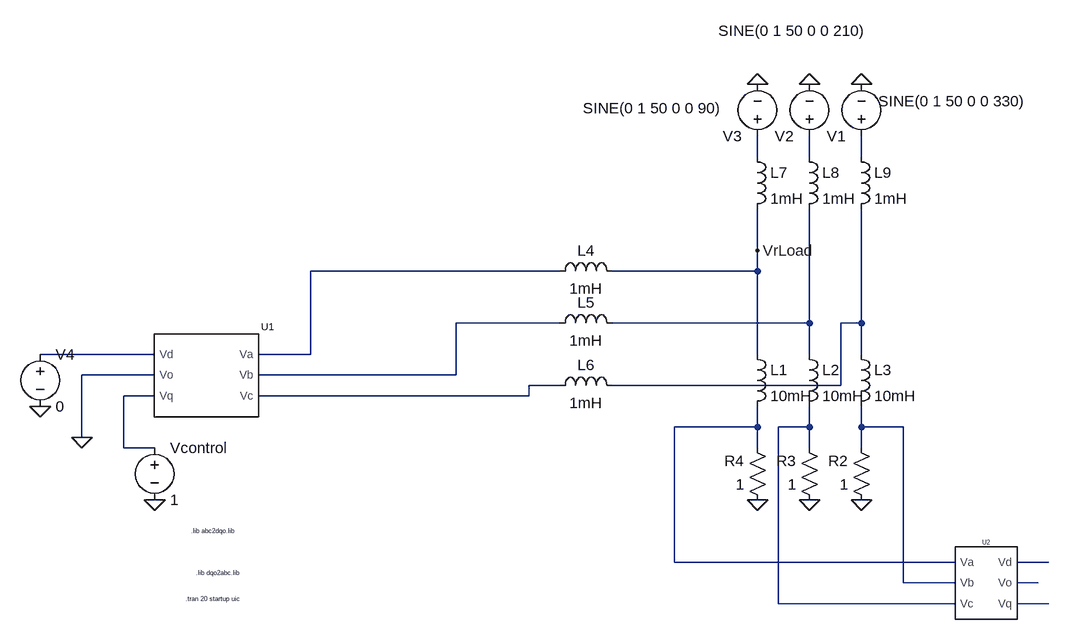
[diagram p0: schematic dqoabc4.asc]
dqoabc4.asc, the LTspice schematic file:
Version 4
SHEET 1 3872 1864
WIRE 976 -16 976 -48
WIRE 1056 -16 1056 -48
WIRE 1136 -16 1136 -48
WIRE 976 128 976 64
WIRE 672 160 288 160
WIRE 976 160 976 128
WIRE 976 160 752 160
WIRE 672 240 512 240
WIRE 1056 240 1056 64
WIRE 1056 240 752 240
WIRE 1136 240 1136 64
WIRE 1136 240 1104 240
WIRE 48 288 -128 288
WIRE 288 288 288 160
WIRE 288 288 208 288
WIRE 976 288 976 160
WIRE 1056 288 1056 240
WIRE 1136 288 1136 240
WIRE 48 320 -64 320
WIRE 512 320 512 240
WIRE 512 320 208 320
WIRE 672 336 624 336
WIRE 1104 336 1104 240
WIRE 1104 336 752 336
WIRE 48 352 0 352
WIRE 624 352 624 336
WIRE 624 352 208 352
WIRE 976 400 976 368
WIRE 976 400 848 400
WIRE 1056 400 1056 368
WIRE 1056 400 1008 400
WIRE 1136 400 1136 368
WIRE 1200 400 1136 400
WIRE -64 416 -64 320
WIRE 0 432 0 352
WIRE 48 432 0 432
WIRE 976 432 976 400
WIRE 1056 432 1056 400
WIRE 1136 432 1136 400
WIRE 848 608 848 400
WIRE 1280 608 848 608
WIRE 1424 608 1376 608
WIRE 1200 640 1200 400
WIRE 1280 640 1200 640
WIRE 1408 640 1376 640
WIRE 1008 672 1008 400
WIRE 1280 672 1008 672
WIRE 1424 672 1376 672
FLAG -128 368 0
FLAG -64 416 0
FLAG 1136 -128 0
FLAG 1056 -128 0
FLAG 976 -128 0
FLAG 1136 512 0
FLAG 1056 512 0
FLAG 976 512 0
FLAG 48 512 0
FLAG 976 128 VrLoad
SYMBOL dqabc 128 320 R0
SYMATTR InstName U1
SYMBOL abc2dqo 1328 640 R0
SYMATTR InstName U2
SYMBOL voltage 1136 -32 R180
WINDOW 3 -253 70 Left 2
WINDOW 123 0 0 Left 0
WINDOW 39 0 0 Left 0
SYMATTR Value SINE(0 1 50 0 0 330)
SYMATTR InstName V1
SYMBOL voltage 1056 -32 R180
WINDOW 3 -87 178 Left 2
WINDOW 123 0 0 Left 0
WINDOW 39 0 0 Left 0
SYMATTR Value SINE(0 1 50 0 0 210)
SYMATTR InstName V2
SYMBOL voltage 976 -32 R180
WINDOW 123 0 0 Left 0
WINDOW 39 0 0 Left 0
WINDOW 3 55 59 Left 2
SYMATTR InstName V3
SYMATTR Value SINE(0 1 50 0 0 90)
SYMBOL res 1152 528 R180
WINDOW 0 36 76 Left 2
WINDOW 3 36 40 Left 2
SYMATTR InstName R2
SYMATTR Value 1
SYMBOL res 1072 528 R180
WINDOW 0 36 76 Left 2
WINDOW 3 36 40 Left 2
SYMATTR InstName R3
SYMATTR Value 1
SYMBOL res 992 528 R180
WINDOW 0 36 76 Left 2
WINDOW 3 36 40 Left 2
SYMATTR InstName R4
SYMATTR Value 1
SYMBOL ind 960 272 R0
SYMATTR InstName L1
SYMATTR Value 10mH
SYMBOL ind 1040 272 R0
SYMATTR InstName L2
SYMATTR Value 10mH
SYMBOL ind 1120 272 R0
SYMATTR InstName L3
SYMATTR Value 10mH
SYMBOL voltage -128 272 R0
WINDOW 123 0 0 Left 0
WINDOW 39 0 0 Left 0
SYMATTR InstName V4
SYMATTR Value 0
SYMBOL ind 960 -32 R0
SYMATTR InstName L7
SYMATTR Value 1mH
SYMBOL ind 1040 -32 R0
SYMATTR InstName L8
SYMATTR Value 1mH
SYMBOL ind 1120 -32 R0
SYMATTR InstName L9
SYMATTR Value 1mH
SYMBOL voltage 48 416 R0
WINDOW 123 0 0 Left 0
WINDOW 39 0 0 Left 0
SYMATTR InstName Vcontrol
SYMATTR Value 1
SYMBOL ind 656 176 R270
WINDOW 0 32 56 VTop 2
WINDOW 3 5 56 VBottom 2
SYMATTR InstName L4
SYMATTR Value 1mH
SYMBOL ind 656 256 R270
WINDOW 0 32 56 VTop 2
WINDOW 3 5 56 VBottom 2
SYMATTR InstName L5
SYMATTR Value 1mH
SYMBOL ind 656 352 R270
WINDOW 0 32 56 VTop 2
WINDOW 3 5 56 VBottom 2
SYMATTR InstName L6
SYMATTR Value 1mH
TEXT 96 664 Left 0 !.tran 20 startup uic
TEXT 112 624 Left 0 !.lib dqo2abc.lib
TEXT 104 560 Left 0 !.lib abc2dqo.lib

The netlist it stands for:
* dqoabc4.asc
XU1 N008 0 N010 N004 N005 N009 dqo2abc  ; pins Vd Vo Vq Va Vb Vc
XU2 N011 N013 N012 N014 N015 N016 abc2dqo  ; pins Va Vb Vc Vd Vo Vq
V1 N003 0 SINE(0 1 50 0 0 330)
V2 N002 0 SINE(0 1 50 0 0 210)
V3 N001 0 SINE(0 1 50 0 0 90)
R2 0 N013 1
R3 0 N012 1
R4 0 N011 1
L1 VrLoad N011 10mH
L2 N006 N012 10mH
L3 N007 N013 10mH
V4 N008 0 0
L7 N001 VrLoad 1mH
L8 N002 N006 1mH
L9 N003 N007 1mH
Vcontrol N010 0 1
L4 N004 VrLoad 1mH
L5 N005 N006 1mH
L6 N009 N007 1mH
.tran 20 startup uic
.lib dqo2abc.lib
.lib abc2dqo.lib
.backanno
.end